# Altium schematic sheet Oscillator_50MHz.SchDoc: Oscillator 50MHz
size A4
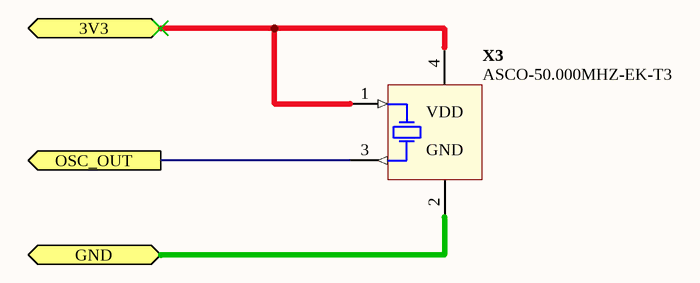
[diagram p0: Oscillator_50MHz.SchDoc]

## Parts
X3  ASCO-50.000MHZ-EK-T3  [ABRA-ASCO-50.000MHZ-EK-T3-4_V]

## Ports
3V3, GND, OSC_OUT (out)

## Nets
3V3: X3.1(STAND-BY) X3.4(VDD) ; port 3V3
GND: X3.2(GND) ; port GND
OSC_OUT: X3.3(OUTPUT) ; port OSC_OUT

## Notes on the sheet
- Sheet Title
- Project Title
- Size:
- Date:
- A4
- Item:
- Time:
- Revision:
- Sheet
- of
- File:

## Library data of the parts
X3 = CMP-0461-00001-1: Crystal Clock Oscillator, 50 MHz, -20 to 70 degC, 1.6 x 1.2 x 0.7 mm SMD; Manufacturer: Abracon; Frequency(MHz): 50; Supply Current (Idd) into 15pF Load: 6 mA; Supply Voltage (Vdd): 3.3 V; Aging: -3 to 3 3 ppm; Overall Frequency Stability: +/-30 ppm; Output Load: 15 pF; Packing: Tape and Reel; PackageDescription: 4-Pin Hand Drawn, Body 1.6 x 1.2 mm; ComponentLink3Description: Package Specification; ComponentLink2URL: http://www.abracon.com/Oscillators/ASCO.pdf; PartNumber: ASCO-50.000MHZ-EK-T3; ComponentLink3URL: http://www.abracon.com/Oscillators/ASCO.pdf; ComponentLink2Description: Datasheet; DatasheetVersion: 01.25.13; Operating Temperature: -20 to 70 degC; ComponentLink1URL: http://www.abracon.com; PackageReference: ASCO-50.000MHZ-EK-T3-4; Mounting Technology: Surface Mount; ComponentLink1Description: Manufacturer URL